# EAGLE design ue-keyer (EAGLE 7.5.0)
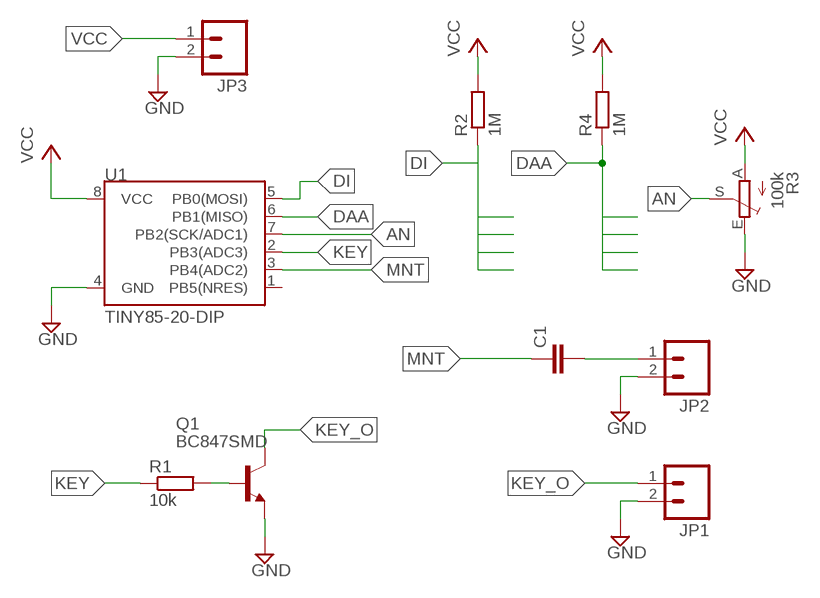
[diagram p0: schematic, sheet 1]

## Parts
C1  C-EUC1206  [C1206]
JP1  M02LOCK_LONGPADS  [1X02_LOCK_LONGPADS]
JP2  M02LOCK_LONGPADS  [1X02_LOCK_LONGPADS]
JP3  M02LOCK_LONGPADS  [1X02_LOCK_LONGPADS]
Q1  BC847SMD  [SOT23]
R1  10k  R-EU_R0805  [R0805]
R2  1M  R-EU_R0805  [R0805]
R3  100k  TRIM_EU-ECP10S  [ECP10S]
R4  1M  R-EU_R0805  [R0805]
U1  TINY85-20-DIP  ATTINY45TINY85-20-DIP  [DIP08]

## Nets
AN: R3.S U1.7(PB2(SCK/ADC1))
DAA: R4.1 U1.6(PB1(MISO))
DI: R2.1 U1.5(PB0(MOSI))
GND: JP1.2 JP2.2 JP3.2 Q1.2(E) R3.E U1.4(GND)
KEY: R1.1 U1.2(PB3(ADC3))
KEY_O: JP1.1 Q1.3(C)
MNT: C1.1 U1.3(PB4(ADC2))
MNT_O: C1.2 JP2.1
N$1: Q1.1(B) R1.2
VCC: JP3.1 R2.2 R3.A R4.2 U1.8(VCC)
Unconnected: U1.1(PB5(NRES))

## Library data of the parts
C1 = rcl:C-EU: CAPACITOR, European symbol
JP1-JP3 = SparkFun-Connectors:M02: Standard 2-pin 0.1" header. Use with - straight break away headers ( PRT-00116) - right angle break away headers (PRT-00553) - swiss pins (PRT-00743) - machine pins (PRT-00117) - female headers (PRT-00115) Molex polarized connector foot print use with: PRT-08233 with associated crimp pins and housings. 2.54_SCREWTERM for use with PRT-10571. 3.5mm Screw Terminal footprints for PRT-08084 5mm Screw Terminal footprints for use with PRT-08432
Q1 = transistor-npn:BC847*: NPN Transistor
R1 R2 R4 = rcl:R-EU_: RESISTOR, European symbol
R3 = pot:TRIM_EU-: POTENTIOMETER
U1 = SparkFun-DigitalIC:ATTINY45: Atmel 8-pin 2/4/8kB flash uC; PROD_ID: IC-09445

## Board
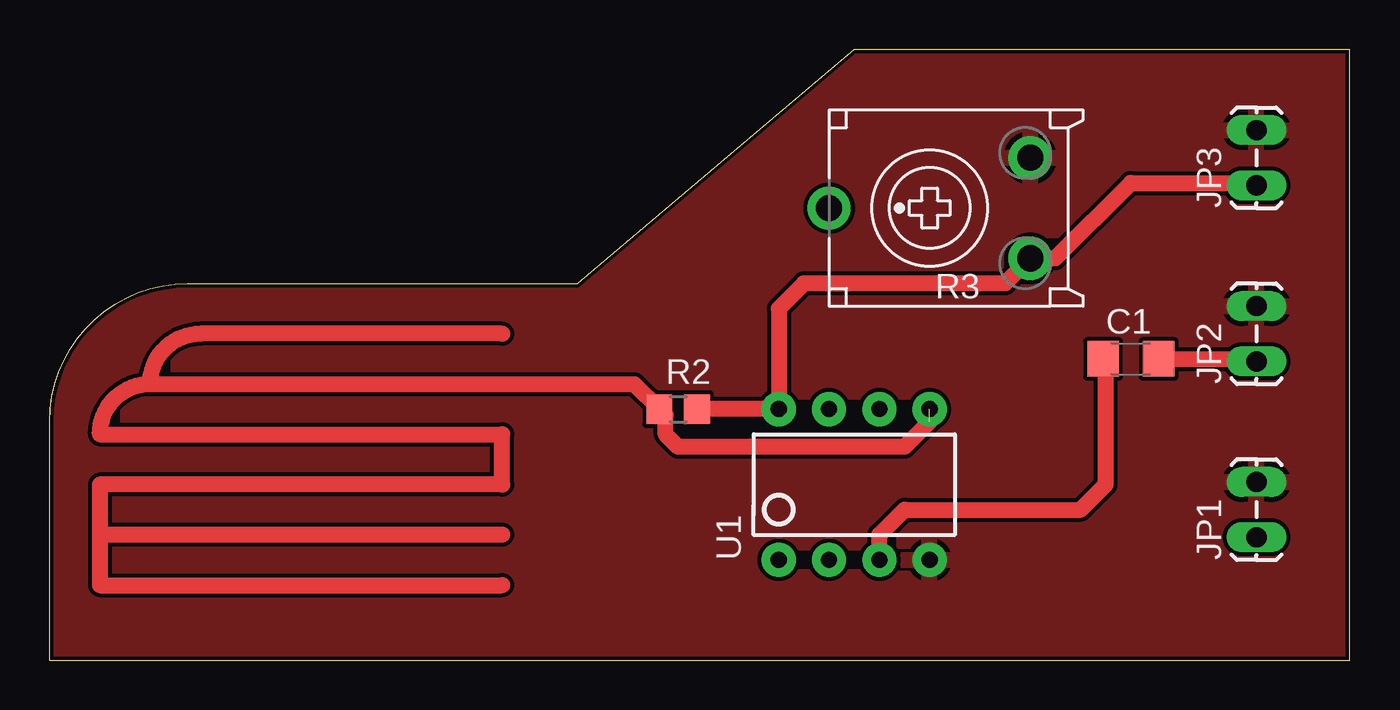
[diagram p1: board, top side]
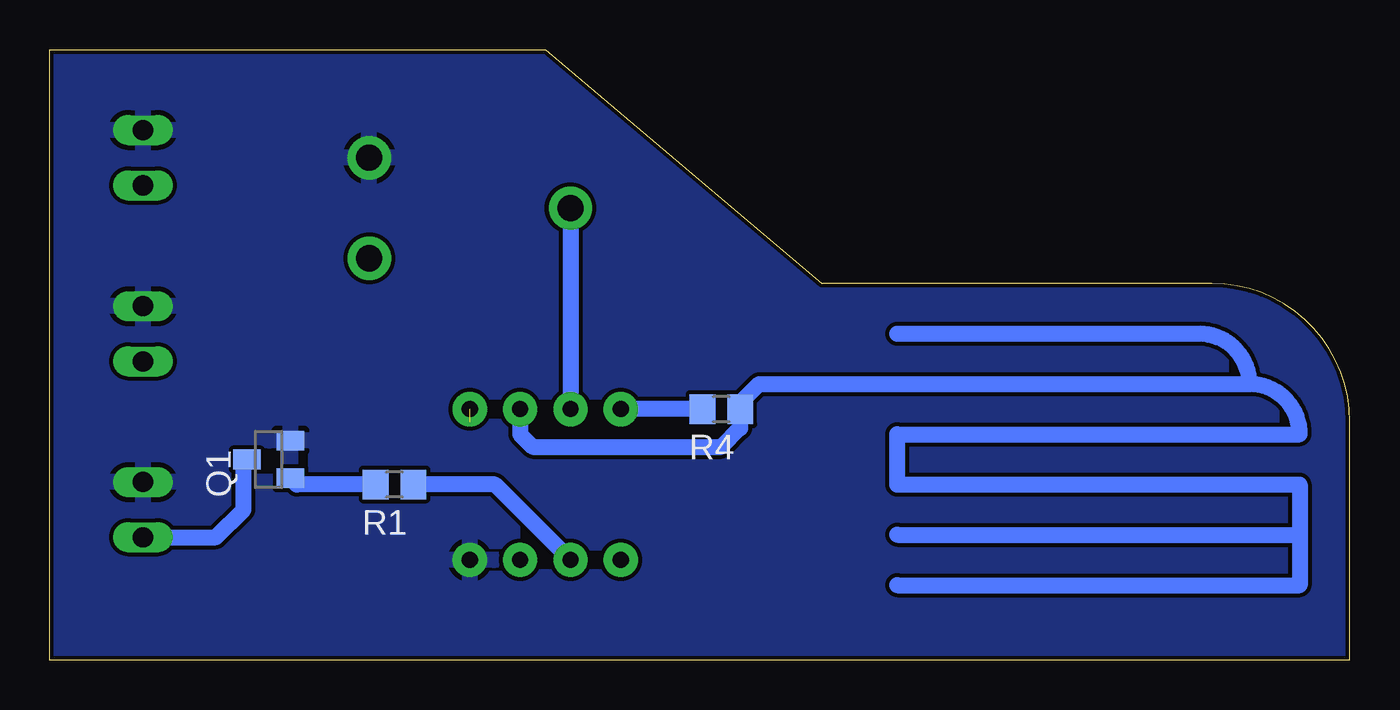
[diagram p2: board, bottom side, seen from below]

Size 65.68 x 30.87 mm. Coordinates in mm from the lower left corner, seen from the top.
Outline: 0,0 65.68,0 65.68,30.87 40.64,30.87 26.67,19.05 6.99,19.05 arc90 0,12.06 0,0
Copper layers (1*16): Top 0.035mm / dielectric 1.5mm / Bottom 0.035mm
Design rules "default *": minimum track width 10mil, minimum drill 24mil, track to track 8mil, track to pad 8mil, pad to pad 8mil, via to via 8mil, smd to smd 8mil, copper to edge 8mil, drill to drill 8mil, minimum pad ring 10mil, minimum via ring 8mil, stop-mask expansion 4mil, vias tented up to drill 0mil, thermal gap 10mil

### Footprints (pad centres in the part's own frame; a part is rotated, then mirrored left to right if it is on the bottom)
C1206 = smd 1.6 x 1.8: 1 -1.4,0; 2 1.4,0
1X02_LOCK_LONGPADS = drill 1.016 long: 1 -0.127,0; 2 2.667,0
SOT23 = smd 1 x 1.4: 1 -0.95,-1.1; 2 0.95,-1.1; 3 0,1.1
R0805 = smd 1.3 x 1.5: 1 -0.95,0; 2 0.95,0
ECP10S = drill 1.321 pad 2.184: A -2.54,-5.08; E 2.54,-5.08; S 0,5.08
DIP08 = drill 0.813 pad 1.727: 1 -3.81,-3.81; 2 -1.27,-3.81; 3 1.27,-3.81; 4 3.81,-3.81; 5 3.81,3.81; 6 1.27,3.81; 7 -1.27,3.81; 8 -3.81,3.81

### Placement (x,y rotation side)
C1  54.61,15.24 0 top
JP1  60.96,6.35 90 top
JP2  60.96,15.24 90 top
JP3  60.96,24.13 90 top
Q1  54.61,10.16 90 bottom
R1  48.26,8.89 180 bottom
R2  31.75,12.7 0 top
R3  44.45,22.86 90 top
R4  31.75,12.7 180 bottom
U1  40.64,8.89 0 top

### Tracks (layer width: path | path; a pad name or v marks a point on that pad's centre or on a via)
AN
  Bottom 0.813: R3.S U1.7
DAA
  Bottom 0.813: U1.6 41.91,11.43 41.27,10.79 31.75,10.79 30.8,11.74 R4.1 30.8,13.02 29.84,13.97 5.08,13.97 | 22.86,16.51 7.62,16.51 arc90 5.08,13.97 | 22.86,3.81 2.54,3.81 2.54,6.35 | 22.86,6.35 2.54,6.35 | 5.08,13.97 arc90 2.54,11.43 22.86,11.43 22.86,8.89 2.54,8.89 2.54,6.35
DI  (1 unrouted)
  Top 0.813: 22.86,3.81 2.54,3.81 2.54,6.35 | 22.86,16.51 7.62,16.51 arc90 5.08,13.97 | 22.86,6.35 2.54,6.35 | 5.08,13.97 29.53,13.97 R2.1 31.11,12.38 31.11,11.43 31.75,10.79 43.18,10.79 44.45,12.06 | 5.08,13.97 arc90 2.54,11.43 22.86,11.43 22.86,8.89 2.54,8.89 2.54,6.35
GND
  pour Bottom: 0,0 0,30.48 66.04,30.48 66.04,0
  pour Top: 0,0 0,34.29 66.04,34.29 66.04,0
KEY
  Bottom 0.813: U1.2 43.18,8.89 R1.1
KEY_O
  Bottom 0.813: JP1.1 57.28,6.22 55.88,7.62 55.88,9.99 Q1.3
MNT
  Top 0.813: U1.3 41.91,6.35 43.18,7.62 52.07,7.62 53.34,8.89 53.34,15.11 C1.1
MNT_O
  Top 0.813: C1.2 60.83,15.24 JP2.1
N$1
  Bottom 0.813: R1.2 53.19,8.89 Q1.1
VCC
  Top 0.813: R4.2 U1.8 36.83,17.78 38.1,19.05 48.26,19.05 R3.A 50.8,20.32 54.61,24.13 60.83,24.13 JP3.1
  Bottom 0.813: R4.2 U1.8